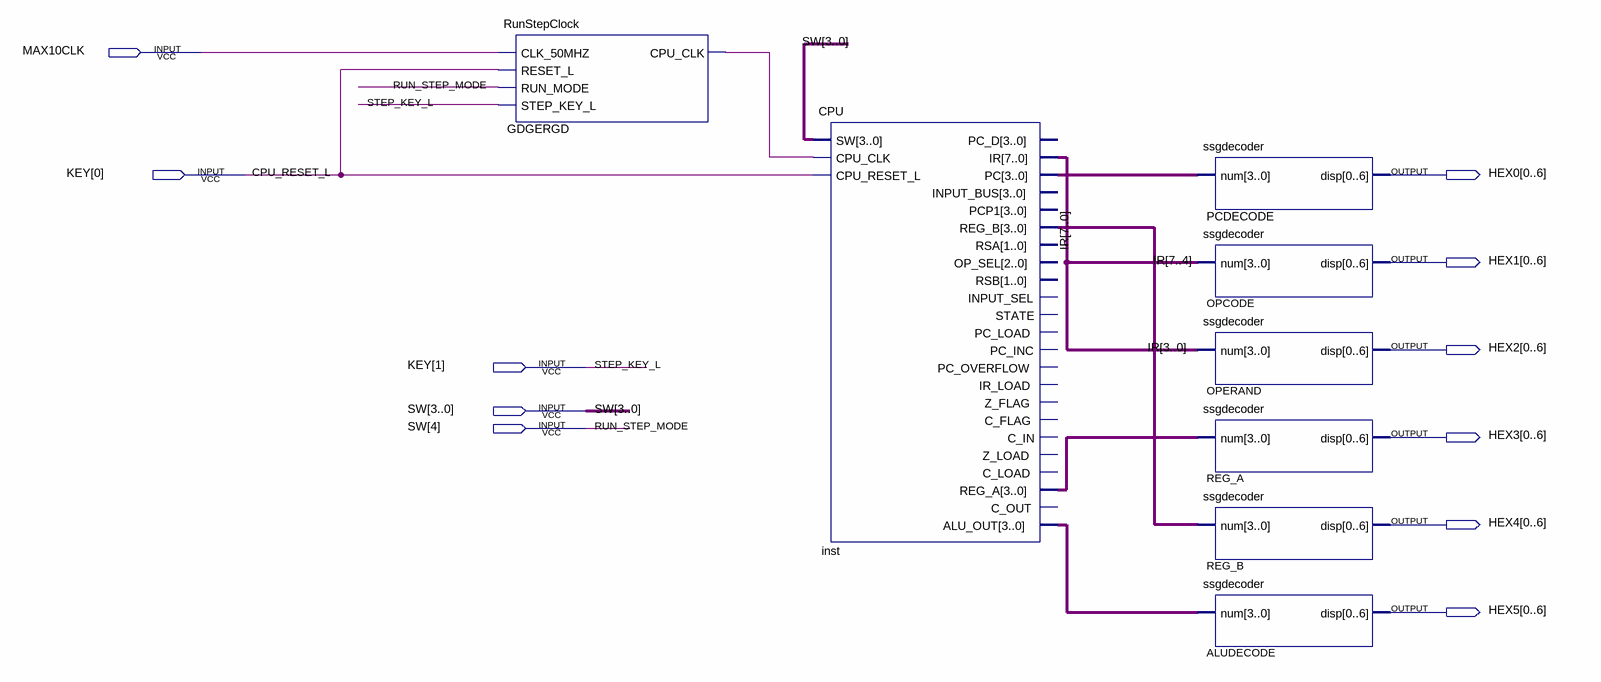
[diagram p0: schematic sheet]
// Quartus schematic DE10_TOP.bdf as structural Verilog: 8 symbols, 11 pins
module DE10_TOP (
  input  MAX10CLK,
  input  [1:0] KEY,
  input  [4:0] SW,
  output [0:6] HEX0,
  output [0:6] HEX1,
  output [0:6] HEX2,
  output [0:6] HEX3,
  output [0:6] HEX4,
  output [0:6] HEX5
);

  wire GDGERGD_cpu_clk;
  wire [3:0] inst_alu_out, inst_pc, inst_reg_a, inst_reg_b;
  wire [7:0] IR;

  RunStepClock GDGERGD (
    .CLK_50MHZ(MAX10CLK), .RESET_L(KEY[0]), .RUN_MODE(SW[4]), .STEP_KEY_L(KEY[1]), .CPU_CLK(GDGERGD_cpu_clk));
  CPU inst (
    .SW(SW[3:0]), .CPU_CLK(GDGERGD_cpu_clk), .CPU_RESET_L(KEY[0]), .IR(IR), .PC(inst_pc), .REG_B(inst_reg_b),
    .REG_A(inst_reg_a), .ALU_OUT(inst_alu_out));  // open: PC_D, INPUT_BUS, PCP1, RSA, OP_SEL, RSB, INPUT_SEL, STATE, PC_LOAD, PC_INC, PC_OVERFLOW, IR_LOAD, Z_FLAG, C_FLAG, C_IN, Z_LOAD, C_LOAD, C_OUT
  ssgdecoder PCDECODE (.num(inst_pc), .disp(HEX0));
  ssgdecoder OPCODE (.num(IR[7:4]), .disp(HEX1));
  ssgdecoder OPERAND (.num(IR[3:0]), .disp(HEX2));
  ssgdecoder REG_A (.num(inst_reg_a), .disp(HEX3));
  ssgdecoder REG_B (.num(inst_reg_b), .disp(HEX4));
  ssgdecoder ALUDECODE (.num(inst_alu_out), .disp(HEX5));

  // Other names for the same wires on the sheet: CPU_RESET_L = KEY[0]; RUN_STEP_MODE = SW[4]; STEP_KEY_L = KEY[1]
endmodule
